# EAGLE design hextokWings04a (EAGLE 7.7.0)
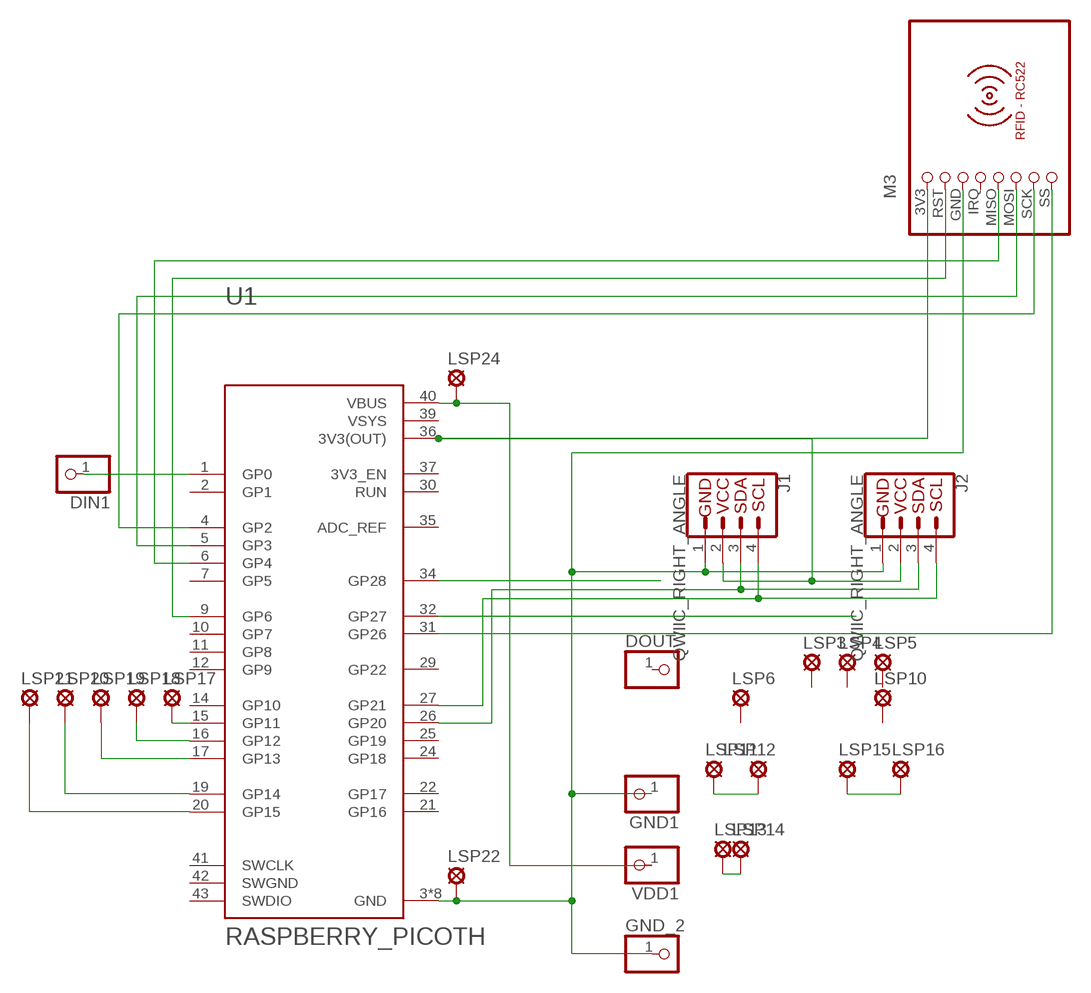
[diagram p0: schematic, sheet 1]

## Parts
DIN1  PINHD-1X1CB  [1X01-CLEANBIG]
DOUT  PINHD-1X1CB  [1X01-CLEANBIG]
GND1  PINHD-1X1CB  [1X01-CLEANBIG]
GND_2  PINHD-1X1CB  [1X01-CLEANBIG]
J1  QWIIC_RIGHT_ANGLE  QWIIC_CONNECTORJS-1MM  [JST04_1MM_RA]
J2  QWIIC_RIGHT_ANGLE  QWIIC_CONNECTORJS-1MM  [JST04_1MM_RA]
LSP3  LSP10  [LSP10]
LSP4  LSP10  [LSP10]
LSP5  LSP10  [LSP10]
LSP6  LSP10  [LSP10]
LSP10  LSP10  [LSP10]
LSP11  LSP10  [LSP10]
LSP12  LSP10  [LSP10]
LSP13  LSP10  [LSP10]
LSP14  LSP10  [LSP10]
LSP15  LSP10  [LSP10]
LSP16  LSP10  [LSP10]
LSP17  LSP10  [LSP10]
LSP18  LSP10  [LSP10]
LSP19  LSP10  [LSP10]
LSP20  LSP10  [LSP10]
LSP21  LSP10  [LSP10]
LSP22  LSP10  [LSP10]
LSP24  LSP10  [LSP10]
M3  RFID-RC522  [RFID-RC522]
U1  RASPBERRY_PICOTH  [PICO-PKG-TH]
VDD1  PINHD-1X1CB  [1X01-CLEANBIG]

## Nets
N$1: J1.2 J2.2 M3.3V3 U1.36(3V3(OUT))
N$2: M3.MOSI U1.5(GP3)
N$3: M3.SCK U1.4(GP2)
N$4: M3.RST U1.9(GP6)
N$5: U1.34(GP28)
N$7: U1.32(GP27)
N$8: M3.SS U1.31(GP26)
N$9: DIN1.1 U1.1(GP0)
N$10: LSP24.MP U1.40(VBUS) VDD1.1
N$11: M3.MISO U1.6(GP4)
N$12: LSP11.MP LSP12.MP
N$13: LSP13.MP LSP14.MP
N$14: LSP15.MP LSP16.MP
N$15: LSP17.MP U1.15(GP11)
N$16: LSP18.MP U1.16(GP12)
N$17: LSP19.MP U1.17(GP13)
N$18: LSP20.MP U1.19(GP14)
N$19: LSP21.MP U1.20(GP15)
N$20: J1.3 J2.3 U1.26(GP20)
N$21: J1.4 J2.4 U1.27(GP21)
N$23: GND1.1 GND_2.1 J1.1 J2.1 LSP22.MP M3.GND U1.3(GND) U1.8(GND) U1.13(GND) U1.18(GND) U1.23(GND) U1.28(GND) U1.33(GND) U1.38(GND)
Unconnected: DOUT.1 LSP3.MP LSP4.MP LSP5.MP LSP6.MP LSP10.MP M3.IRQ U1.2(GP1) U1.7(GP5) U1.10(GP7) U1.11(GP8) U1.12(GP9) U1.14(GP10) U1.21(GP16) U1.22(GP17) U1.24(GP18) U1.25(GP19) U1.29(GP22) U1.30(RUN) U1.35(ADC_REF) U1.37(3V3_EN) U1.41(SWCLK) U1.43(SWDIO)

## Power pins joined to a net without a drawn wire
SWGND: U1.42(SWGND)
VSYS: U1.39(VSYS)

## Library data of the parts
DIN1 DOUT GND1 GND_2 VDD1 = NeoPixelRing:PINHD-1X1: Pin header 1x1 for 0.1" spacing With round pins
J1 J2 = SparkFun-Connectors:QWIIC_CONNECTOR: SparkFun I2C Standard Qwiic Connector An SMD 1mm pitch JST connector makes it easy and quick (get it? Qwiic?) to connect I2C devices to each other. The Qwiic system <http://www.sparkfun.com/qwiic> enables fast and solderless connection between popular platforms and various sensors and actuators. We carry 200mm <https://www.sparkfun.com/products/14204>, 100mm <https://www.sparkfun.com/products/14205>, 50mm <https://www.sparkfun.com/products/14206>, and breadboard friendly <https://www.sparkfun.com/products/14207> Qwiic cables. We also offer 10 pcs strips <https://www.sparkfun.com/products/14323> the SMD connectors.; PROD_ID: CONN-13694
LSP3-LSP6 LSP10-LSP22 LSP24 = solpad:LSP10: SOLDER PAD drill 1.0 mm, distributor Buerklin, 12H555
M3 = mfrc522-module:RFID-RC522: RFID-RC522 MFRC-522 based breakout board
U1 = RpiPico:RASPBERRY_PICO: Raspberry Pi Pico

## Board
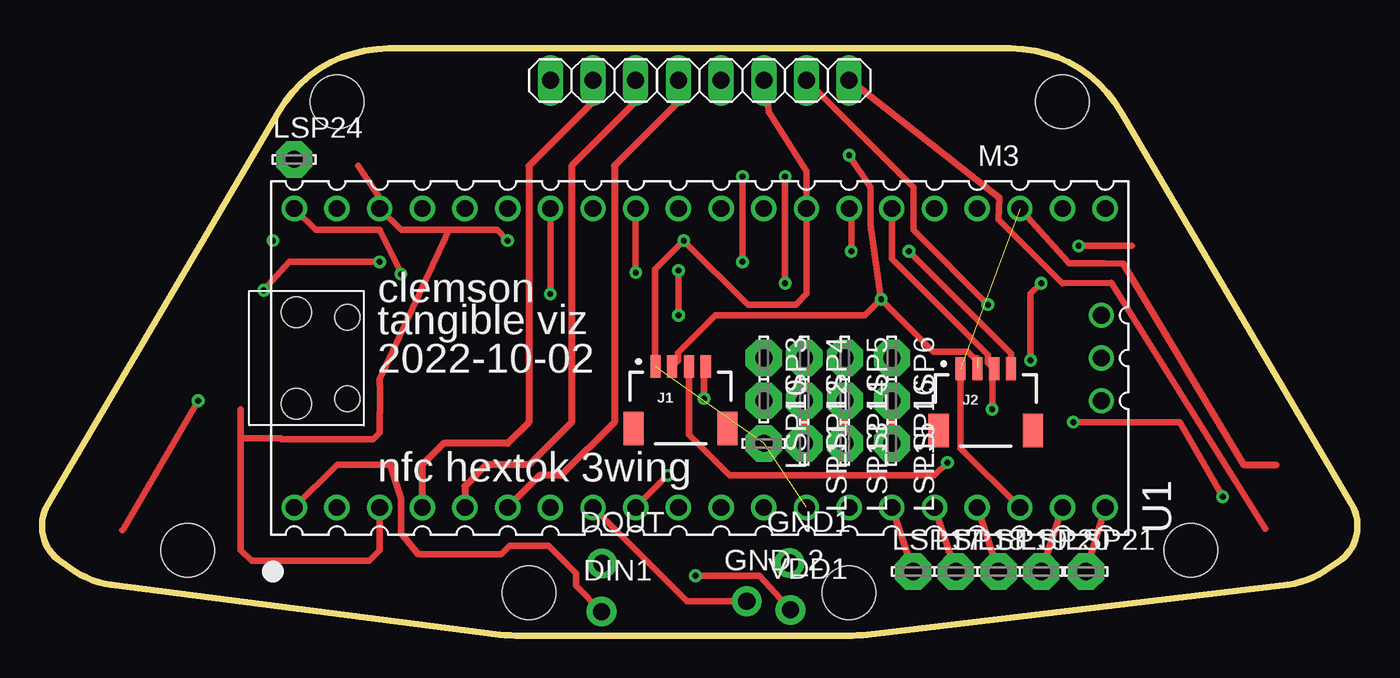
[diagram p1: board, top side]
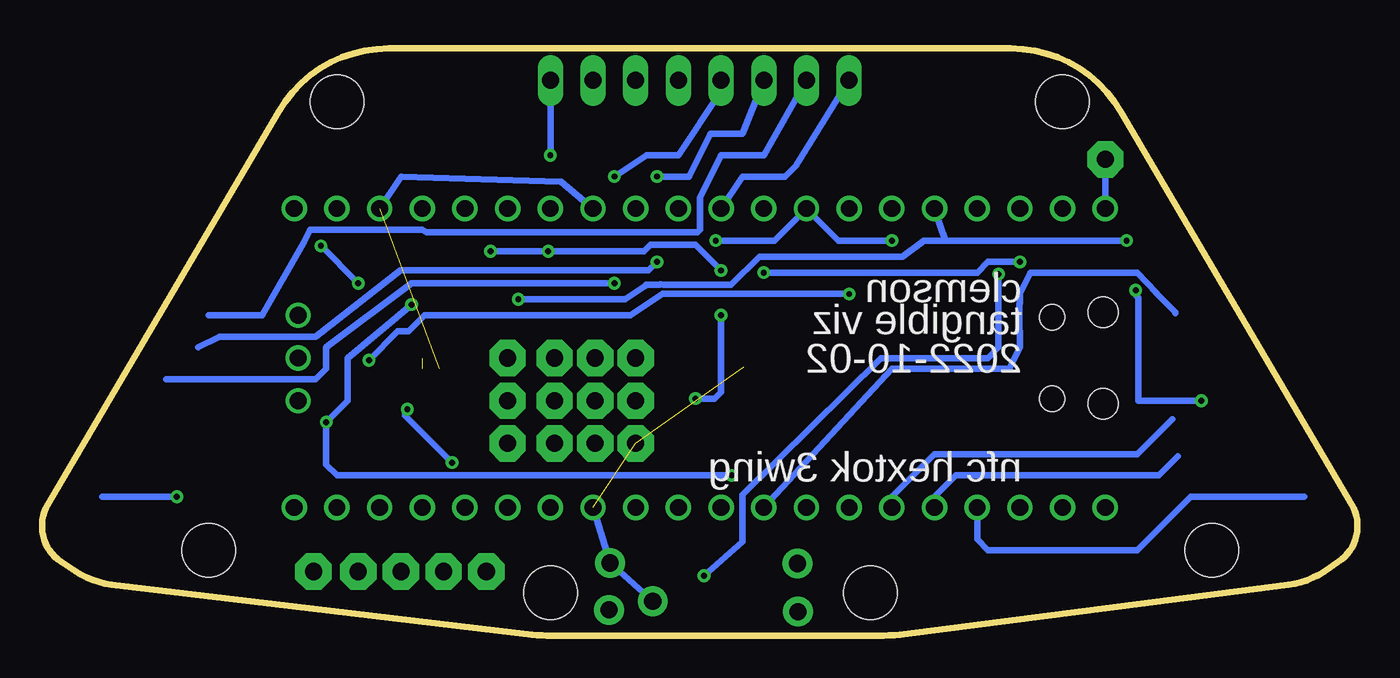
[diagram p2: board, bottom side, seen from below]

Size 78.28 x 34.92 mm. Coordinates in mm from the lower left corner, seen from the top.
Outline: 74.13,3.03 49.11,0.05 arc-7 48.21,0 28.19,0 arc-7 27.23,0.06 4.12,3.02 arc-26 1.95,3.84 1.13,4.38 arc-87 0.35,7.78 14.07,31.16 arc-60 20.64,34.92 57.64,34.92 arc-60 64.21,31.16 77.93,7.78 arc-87 77.15,4.38 76.34,3.85 arc-27 74.13,3.03
Copper layers (1*16): Top 0.035mm / dielectric 1.5mm / Bottom 0.035mm
Design rules "default": minimum track width 6mil, minimum drill 0.35mm, track to track 6mil, track to pad 6mil, pad to pad 6mil, via to via 6mil, smd to smd 6mil, copper to edge 40mil, drill to drill 6mil, minimum pad ring 10mil, minimum via ring 8mil, stop-mask expansion 4mil, vias tented up to drill 0mil, thermal gap 10mil
Holes 3.17 mm at 17.55,31.75 60.73,31.75 8.66,5.08 68.35,5.08 28.98,2.54 48.03,2.54

### Footprints (pad centres in the part's own frame; a part is rotated, then mirrored left to right if it is on the bottom)
1X01-CLEANBIG = drill 1.016 pad 1.778: 1 0,0
JST04_1MM_RA = smd 0.6 x 1.35: 1 -1.5,0; 2 -0.5,0; 3 0.5,0; 4 1.5,0 | smd 1.2 x 2: NC1 2.8,-3.675; NC2 -2.8,-3.675
LSP10 = drill 1.016 pad 2.159 octagon: MP 0,0
RFID-RC522 = drill 1.016 long: 3V3 -8.89,0; GND -3.81,0; IRQ -1.27,0; MISO 1.27,0; MOSI 3.81,0; RST -6.35,0; SCK 6.35,0; SS 8.89,0
PICO-PKG-TH = drill 1: 1 -8.89,24.13; 2 -8.89,21.59; 3 -8.89,19.05; 4 -8.89,16.51; 5 -8.89,13.97; 6 -8.89,11.43; 7 -8.89,8.89; 8 -8.89,6.35; 9 -8.89,3.81; 10 -8.89,1.27; 11 -8.89,-1.27; 12 -8.89,-3.81; 13 -8.89,-6.35; 14 -8.89,-8.89; 15 -8.89,-11.43; 16 -8.89,-13.97; 17 -8.89,-16.51; 18 -8.89,-19.05; 19 -8.89,-21.59; 20 -8.89,-24.13; 21 8.89,-24.13; 22 8.89,-21.59; 23 8.89,-19.05; 24 8.89,-16.51; 25 8.89,-13.97; 26 8.89,-11.43; 27 8.89,-8.89; 28 8.89,-6.35; 29 8.89,-3.81; 30 8.89,-1.27; 31 8.89,1.27; 32 8.89,3.81; 33 8.89,6.35; 34 8.89,8.89; 35 8.89,11.43; 36 8.89,13.97; 37 8.89,16.51; 38 8.89,19.05; 39 8.89,21.59; 40 8.89,24.13; 41 -2.54,-23.9; 42 0,-23.9; 43 2.54,-23.9 | hole 1.8: -2.725,24; 2.725,24 | hole 1.5: -2.425,20.97; 2.425,20.97

### Placement (x,y rotation side)
DIN1  33.3,1.43 0 top
DOUT  33.33,4.29 0 top
GND1  44.47,4.32 0 top
GND_2  41.93,2.03 0 top
J1  38,16 0 top
J2  56.16,15.88 0 top
LSP3  42.95,16.51 270 top
LSP4  45.36,16.51 270 top
LSP5  47.77,16.51 270 top
LSP6  50.57,16.51 270 top
LSP10  42.95,13.97 270 top
LSP11  45.36,11.43 270 top
LSP12  45.36,13.97 270 top
LSP13  47.77,11.43 270 top
LSP14  47.77,13.97 270 top
LSP15  50.57,11.43 270 top
LSP16  50.57,13.97 270 top
LSP17  51.84,3.81 0 top
LSP18  54.38,3.81 0 top
LSP19  56.92,3.81 0 top
LSP20  59.46,3.81 0 top
LSP21  62.13,3.81 0 top
LSP22  42.95,11.43 0 top
LSP24  15.01,28.32 0 top
M3  39.14,33.02 180 top
U1  39.14,16.51 90 top
VDD1  44.54,1.52 0 top

### Tracks (layer width: path | path; a pad name or v marks a point on that pad's centre or on a via)
N$1  (via drill 0.35)  (1 unrouted)
  Top 0.381: M3.3V3 48.31,32.85 56.98,26.03 56.92,24.77 60.73,20.96 63.64,20.99 72.79,6.35 | v49.93,20 49.3,24.45 49.3,26.67 v48.03,28.58 | 55.65,16.51 55.48,16.51 55.1,16.89 53.04,16.89 v49.93,20 | J1.2 37.85,16.36 37.85,16.82 40.08,19.05 48.98,19.05 v49.93,20
  Bottom 0.381: v13.74,23.5 24.53,23.5 | U1.36 24.53,23.5 | 24.53,23.5 25.8,23.5 27.07,22.54 35.58,22.54 37.27,20.85 41.31,20.85 41.47,20.89 41.52,20.85 42.32,20.85 42.35,20.82 43.58,20 v49.93,20 | v48.03,28.58 M3.3V3
N$2  (via drill 0.35)
  Top 0.381: v41.68,27.31 v41.68,22.23
  Top 0.406: M3.MOSI 35.33,31.75 31.52,27.94 31.52,12.7 28.98,10.16 26.44,10.16 25.17,8.89 U1.5
  Bottom 0.381: 10.69,10.67 11.83,9.53 23.9,9.53 25.17,8.26 U1.5 | M3.MOSI 36.6,29.84 38.5,29.84 39.77,27.31 v41.68,27.31 | 68.98,17.15 67.71,17.78 62,17.78 56.93,21.73 48.54,21.73 42.18,21.73 v41.68,22.23
N$3
  Top 0.406: M3.SCK 32.79,31.75 28.98,27.94 28.98,12.7 27.71,11.43 23.9,11.43 22.63,10.16 U1.4
  Bottom 0.381: U1.4 22.63,5.72 21.99,5.08 13.1,5.08 9.93,8.26 3.16,8.26 | M3.SCK 35.33,28.58 37.87,28.58 39.14,26.03 39.14,24.13 39.27,24 55.39,24 55.65,24.13 62.32,24.13 62.71,23.36 65.17,19.05 68.35,19.05
N$4  (via drill 0.35)
  Top 0.381: 45.49,31.75 M3.RST 51.84,26.67 51.84,24.13 v56.28,19.69 | v70.25,8.26 67.71,12.7 v61.36,12.7 | v37.23,9.53 U1.9
  Bottom 0.381: U1.9 27.71,15.88 20.72,15.88 20.09,17.15 20.09,18.09 20.12,18.12 20.12,19.75 20.09,19.78 20.09,20.32 19.45,21.59 13.1,21.59 11.98,20.39 11.98,20.37 10.84,19.23 10.84,19.18 | 74.7,8.26 v70.25,8.26 | v56.28,19.69 60.09,16.51 60.09,13.97 v61.36,12.7 61.36,11.43 | 61.36,11.43 61.36,10.16 60.73,9.53 v37.23,9.53 | 61.36,11.43
N$5  (via drill 0.35)
  Top 0.381: U1.34 v30.25,20.32 | 64.86,23.18 v61.68,23.18 | v58.82,16.38 58.82,20.32 v59.46,20.96
  Bottom 0.381: v30.25,20.32 41.36,20.32 43.27,19.05 55.52,19.05 56.47,18.1 57.11,18.1 v58.82,16.38 | v61.68,23.18 v59.46,20.96
N$7  (via drill 0.35)
  Top 0.381: 4.77,6.27 4.85,6.35 v9.29,13.97 | v20.09,22.23 14.69,22.23 v13.2,20.54 | v35.33,21.59 U1.32
  Bottom 0.381: v20.09,22.23 21.99,22.23 22.63,21.59 v35.33,21.59 | v13.2,20.54 13.2,20.28 13.03,20.11 13.03,13.97 v9.29,13.97
N$8
  Bottom 0.381: M3.SS 33.42,27.94 34.06,27.31 36.6,27.31 U1.31
N$9
  Top 0.381: U1.1 17.55,10.16 20.72,10.16 21.36,8.13 21.36,6.1 22.37,4.83 27.31,4.83 27.82,5.33 30.14,5.33 31.77,3.7 31.77,2.95 DIN1.1
N$10  (via drill 0.35)
  Top 0.381: U1.40 16.28,24.13 20.09,24.13 21.36,21.59 v21.36,21.5 | v38.88,3.56 42.69,3.56 VDD1.1
  Bottom 0.381: 44.22,1.52 VDD1.1 | v21.36,21.5 21.36,17.15 21.99,16.51 28.34,16.51 36.6,8.38 36.6,5.59 v38.88,3.56 | U1.40 LSP24.MP
N$11  (via drill 0.35)
  Top 0.381: v44.22,27.31 v44.22,20.96
  Top 0.406: M3.MISO 37.87,31.75 34.06,27.94 34.06,12.7 30.88,9.53 29.61,9.53 U1.6
  Bottom 0.381: U1.6 27.71,8.26 25.17,10.8 13.1,10.8 11.03,12.87 | v44.22,27.31 42.31,28.58 40.41,28.58 37.87,32.39 M3.MISO | v44.22,20.96 56.28,20.96 61.36,17.15 61.36,15.88 62,15.24 70.89,15.24
N$12
  Top 0.381: LSP12.MP LSP11.MP
N$13
  Top 0.381: LSP14.MP LSP13.MP
N$14
  Top 0.381: LSP16.MP LSP15.MP
N$15
  Top 0.381: U1.15 LSP17.MP
N$16
  Top 0.381: U1.16 LSP18.MP
N$17
  Top 0.381: U1.17 LSP19.MP
N$18
  Top 0.381: U1.19 LSP20.MP
N$19
  Top 0.381: U1.20 LSP21.MP
N$20  (via drill 0.35)
  Top 0.381: U1.26 50.57,22.42 56.3,16.69 56.3,16.23 J2.3 56.54,15.76 v56.54,13.46 | J1.3 38.5,11.95 40.92,9.53 53.11,9.53 v53.87,10.29
  Bottom 0.381: v53.87,10.29 56.66,13.08 56.66,13.46 v56.54,13.46
N$21  (via drill 0.35)
  Top 0.381: J2.4 57.66,16.79 v51.58,22.86 | U1.27 48.16,25.27 v48.16,22.86 | v39.39,14.1 39.39,15.9 J1.4 | v37.87,21.72 v37.87,19.05
  Bottom 0.381: v51.58,22.86 v48.16,22.86 42.44,22.86 42.06,23.24 39.39,23.24 v37.87,21.72 | v37.87,19.05 37.87,14.48 38.25,14.1 v39.39,14.1
N$23  (via drill 0.35)  (3 unrouted)
  Top 0.381: U1.3 20.09,5.08 19.45,4.45 12.47,4.45 11.83,5.08 11.83,11.75 | 11.83,13.46 11.83,11.75 | 18.82,27.94 20.09,26.03 U1.38 21.36,24.13 24.22,24.13 | GND_2.1 38.38,2.03 U1.8 | 24.22,24.13 27.07,24.13 v27.71,23.5 | M3.GND 43.27,31.12 45.49,27.62 U1.28 45.49,20.32 44.85,19.69 42,19.69 v38.19,23.5 36.47,21.78 36.47,16.03 J1.1 | 64.35,22.11 63.21,22.15 63.2,22.16 61.11,22.16 61.05,22.23 58.35,25.24 | 24.22,24.13 20.09,15.24 20.09,14.93 20.12,14.9 20.12,13.28 20.09,13.24 20.09,12.07 19.7,11.68 14.27,11.68 14.2,11.75 11.83,11.75 | J2.1 54.66,11.15 U1.18
  Top 0.406: 58.35,25.24 U1.23 | 64.35,22.11 71.52,10.16 73.43,10.16
  Bottom 0.381: GND1.1 44.22,4.57 | 41.93,2.29 GND_2.1 GND1.1 | 45.49,7.37 U1.13 GND1.1 | v27.71,23.5 30.88,23.5 U1.33 34.69,23.5 v38.19,23.5 | U1.28 47.39,26.99 56.92,27.31 U1.23

### Text on the board
tPlace: clemson | tangible viz | 2022-10-02 | nfc hextok 3wing
bPlace: clemson | tangible viz | 2022-10-02 | nfc hextok 3wing